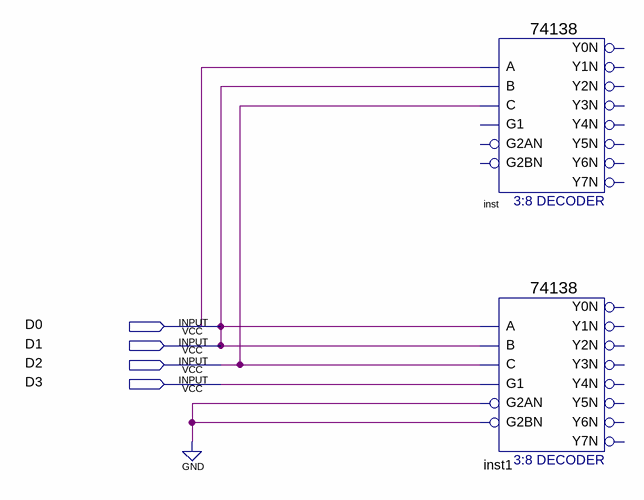
[diagram p0: schematic sheet]
// Quartus schematic Block1.bdf as structural Verilog: 2 symbols, 4 pins
module Block1 (
  input  D0,
  input  D1,
  input  D2,
  input  D3
);

  wire undriven;

  \74138  inst (.A(undriven), .B(D0), .C(D2));  // open: G1, G2AN, G2BN, Y0N, Y1N, Y2N, Y3N, Y4N, Y5N, Y6N, Y7N
  \74138  inst1 (
    .A(D0), .B(D0), .G1(D3), .C(D2), .G2AN(1'b0), .G2BN(1'b0));  // open: Y0N, Y1N, Y2N, Y3N, Y4N, Y5N, Y6N, Y7N

  assign D1 = D0;
endmodule
